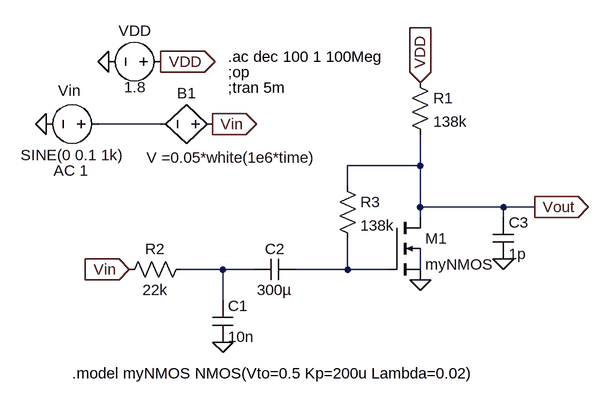
[diagram p0: schematic Simple_NMOS_Amplifier_With_Noise_Filter.asc]
Simple_NMOS_Amplifier_With_Noise_Filter.asc, the LTspice schematic file:
Version 4
SHEET 1 1344 680
WIRE 16 -320 -80 -320
WIRE 416 -256 416 -304
WIRE 416 -256 304 -256
WIRE 304 -224 304 -256
WIRE 416 -192 416 -256
WIRE 544 -192 416 -192
WIRE 592 -192 544 -192
WIRE 416 -176 416 -192
WIRE 544 -176 544 -192
WIRE 112 -96 48 -96
WIRE 160 -96 112 -96
WIRE 304 -96 304 -144
WIRE 304 -96 224 -96
WIRE 368 -96 304 -96
WIRE 416 -96 416 -128
WIRE 112 -48 112 -96
FLAG 416 -80 0
FLAG 592 -192 Vout
IOPIN 592 -192 Out
FLAG 112 16 0
FLAG -64 -416 0
FLAG 16 -416 VDD
IOPIN 16 -416 Out
FLAG 416 -384 VDD
IOPIN 416 -384 In
FLAG 96 -320 Vin
IOPIN 96 -320 Out
FLAG -32 -96 Vin
IOPIN -32 -96 In
FLAG -160 -320 0
FLAG 544 -112 0
SYMBOL voltage 32 -416 R90
WINDOW 0 -63 55 VTop 2
WINDOW 3 55 55 VBottom 2
WINDOW 123 0 0 Left 0
WINDOW 39 0 0 Left 0
SYMATTR InstName VDD
SYMATTR Value 1.8
SYMBOL res 400 -400 R0
SYMATTR InstName R1
SYMATTR Value 138k
SYMBOL bv 112 -320 R90
WINDOW 0 -32 56 VBottom 2
WINDOW 3 36 -13 VTop 2
SYMATTR InstName B1
SYMATTR Value V =0.05*white(1e6*time)
SYMBOL res 64 -112 R90
WINDOW 0 0 56 VBottom 2
WINDOW 3 32 56 VTop 2
SYMATTR InstName R2
SYMATTR Value 22k
SYMBOL cap 96 -48 R0
SYMATTR InstName C1
SYMATTR Value 10n
SYMBOL cap 224 -112 R90
WINDOW 0 0 32 VBottom 2
WINDOW 3 32 32 VTop 2
SYMATTR InstName C2
SYMATTR Value 300µ
SYMBOL res 288 -240 R0
SYMATTR InstName R3
SYMATTR Value 138k
SYMBOL nmos4 368 -176 R0
SYMATTR InstName M1
SYMATTR Value myNMOS
SYMATTR Value2 l=1u w=2u
SYMBOL voltage -64 -320 R90
WINDOW 0 -36 60 VBottom 2
WINDOW 3 32 56 VTop 2
WINDOW 123 87 58 VBottom 2
WINDOW 39 0 0 Left 0
SYMATTR InstName Vin
SYMATTR Value SINE(0 0.1 1k)
SYMATTR Value2 AC 1
SYMBOL cap 528 -176 R0
SYMATTR InstName C3
SYMATTR Value 1p
TEXT 120 -376 Left 2 !;tran 5m
TEXT 120 -424 Left 2 !.ac dec 100 1 100Meg
TEXT 120 -400 Left 2 !;op
TEXT -120 64 Left 2 !.model myNMOS NMOS(Vto=0.5 Kp=200u Lambda=0.02)

The netlist it stands for:
* Simple_NMOS_Amplifier_With_Noise_Filter.asc
VDD VDD 0 1.8
R1 VDD Vout 138k
B1 Vin N001 V =0.05*white(1e6*time)
R2 N002 Vin 22k
C1 N002 0 10n
C2 N003 N002 300µ
R3 Vout N003 138k
M1 Vout N003 0 N004 myNMOS l=1u w=2u
Vin N001 0 SINE(0 0.1 1k) AC 1
C3 Vout 0 1p
.model NMOS NMOS
.model PMOS PMOS
.lib standard.mos
;tran 5m
.ac dec 100 1 100Meg
;op
.model myNMOS NMOS(Vto=0.5 Kp=200u Lambda=0.02)
.backanno
.end